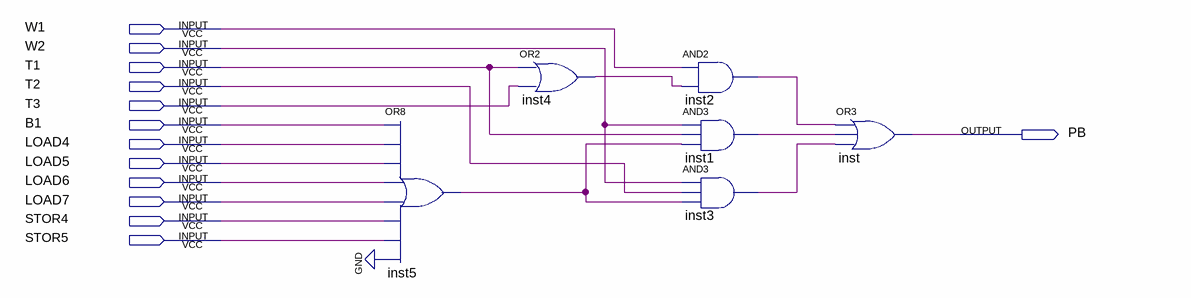
[diagram p0: schematic sheet]
// Quartus schematic PB.bdf as structural Verilog: 6 symbols, 13 pins
module PB (
  input  W1,
  input  W2,
  input  T1,
  input  T2,
  input  T3,
  input  B1,
  input  LOAD4,
  input  LOAD5,
  input  LOAD6,
  input  LOAD7,
  input  STOR4,
  input  STOR5,
  output PB
);

  wire inst1_out, inst2_out, inst3_out, inst4_out, inst5_out;

  or inst5 (inst5_out, B1, LOAD4, LOAD5, LOAD6, LOAD7, STOR4, STOR5, 1'b0);
  or inst4 (inst4_out, T1, T3);
  and inst2 (inst2_out, W1, inst4_out);
  and inst1 (inst1_out, W2, T1, inst5_out);
  and inst3 (inst3_out, W2, T2, inst5_out);
  or inst (PB, inst2_out, inst1_out, inst3_out);
endmodule
